# Altium schematic sheet Interface - Programmer.SchDoc: [13] Interface - Programmer
size A4; ApprovedBy: Nagy Richard; CheckedBy: Nagy Richard; Author: Nagy Richard; CompanyName: EmbedCore; DrawnBy: Nagy Richard; Engineer: Nagy Richard; Organization: EmbedCore; DocumentNumber: 13; Revision: 1.0; SheetNumber: 13; SheetTotal: 15
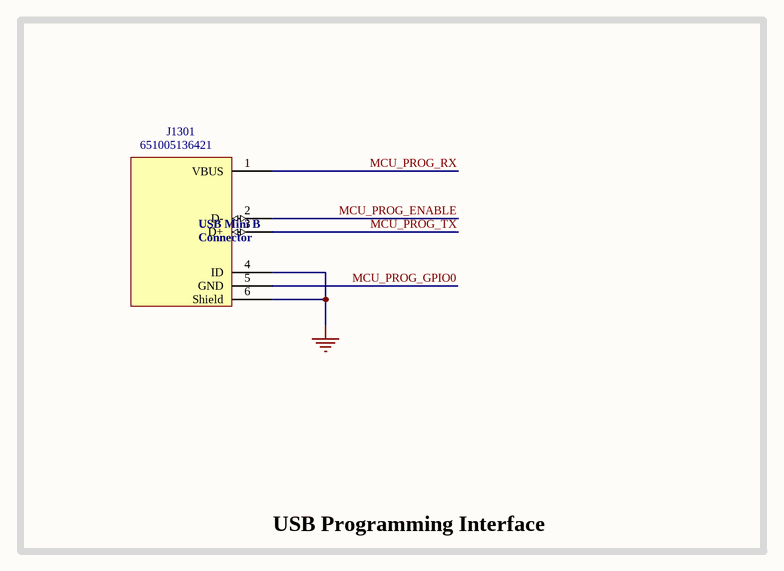
[diagram p0: Interface - Programmer.SchDoc]

## Parts
J1301  651005136421  [651005136421]

## Blocks framed on the sheet
USB Programming Interface: J1301

## Nets
GND: J1301.4(ID) J1301.6(Shield)
MCU_PROG_ENABLE: J1301.2(D-)
MCU_PROG_GPIO0: J1301.5(GND)
MCU_PROG_RX: J1301.1(VBUS)
MCU_PROG_TX: J1301.3(D+)

## Notes on the sheet
- Title:
- Drawn By:
- Page Contents:
- Checked By:
- Size:
- Date:
- File:
- License:
- Email:
- A4
- Number:
- Time:
- Revision:
- Sheet
- Website:
- of
- (in symbol 651005136421) USB Mini B; Connector

## Library data of the parts
J1301 = 651005136421: USB Connectors WR-COM Type B 5Pin Vert Feml Mini